# EAGLE schematic 40m_FT8_BD6CR (EAGLE 9.2.2)
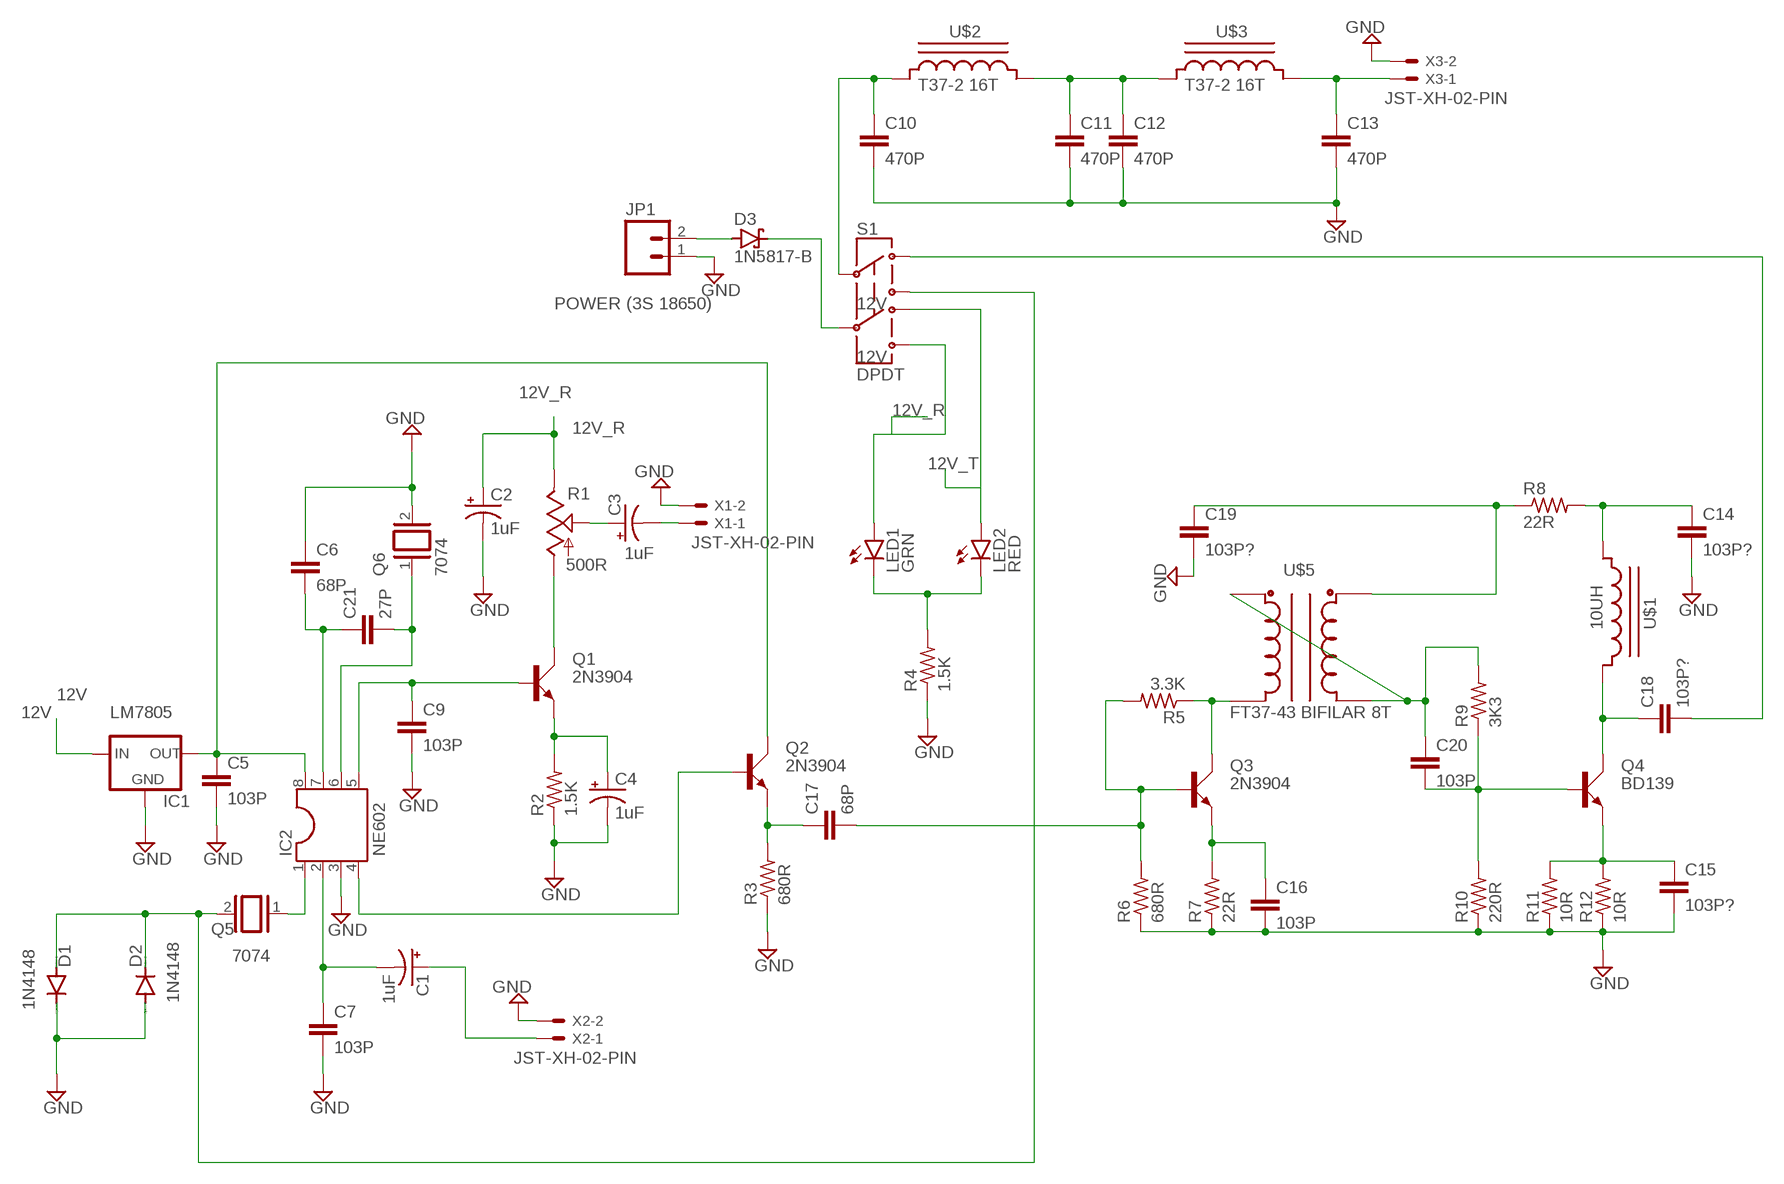
[diagram p0: schematic, sheet 1]

## Parts
C1  1uF  CPOL-USE2-4  [E2-4]
C2  1uF  CPOL-USE2-4  [E2-4]
C3  1uF  CPOL-USE2-4  [E2-4]
C4  1uF  CPOL-USE2-4  [E2-4]
C5  103P  C-EU050-025X075  [C050-025X075]
C6  68P  C-EU050-025X075  [C050-025X075]
C7  103P  C-EU050-025X075  [C050-025X075]
C9  103P  C-EU050-025X075  [C050-025X075]
C10  470P  C-EU050-025X075  [C050-025X075]
C11  470P  C-EU050-025X075  [C050-025X075]
C12  470P  C-EU050-025X075  [C050-025X075]
C13  470P  C-EU050-025X075  [C050-025X075]
C14  103P?  C-EU050-025X075  [C050-025X075]
C15  103P?  C-EU050-025X075  [C050-025X075]
C16  103P  C-EU050-025X075  [C050-025X075]
C17  68P  C-EU050-025X075  [C050-025X075]
C18  103P?  C-EU050-025X075  [C050-025X075]
C19  103P?  C-EU050-025X075  [C050-025X075]
C20  103P  C-EU050-025X075  [C050-025X075]
C21  27P  C-EU050-025X075  [C050-025X075]
D1  1N4148  1N4148DO35-10  [DO35-10]
D2  1N4148  1N4148DO35-10  [DO35-10]
D3  1N5817-B  [DO41-7.6]
IC1  LM7805  V_REG_78XXSIDE  [78XXL]
IC2  NE602  DIL8  [DIL08]
JP1  POWER (3S 18650)  M02-JST-2-PTH-NO_SILK  [JST-2-PTH-NS]
LED1  GRN  LED5MM  [LED_5MM]
LED2  RED  LED5MM  [LED_5MM]
Q1  2N3904  [TO92D]
Q2  2N3904  [TO92D]
Q3  2N3904  [TO92D]
Q4  BD139  2N3904  [TO92D]
Q5  7074  XTAL/S  [QS]
Q6  7074  XTAL/S  [QS]
R1  500R  TRIM_US-CT6  [CT6]
R2  1.5K  R-US_0207/10  [0207/10]
R3  680R  R-US_0207/10  [0207/10]
R4  1.5K  R-US_0207/10  [0207/10]
R5  3.3K  R-US_0207/10  [0207/10]
R6  680R  R-US_0207/10  [0207/10]
R7  22R  R-US_0207/10  [0207/10]
R8  22R  R-US_0207/10  [0207/10]
R9  3K3  R-US_0207/10  [0207/10]
R10  220R  R-US_0207/10  [0207/10]
R11  10R  R-US_0207/10  [0207/10]
R12  10R  R-US_0207/10  [0207/10]
S1  DPDT  SWITCH-DPDTAYZ0202  [AYZ0202]
U$1  10uH  T37_INDUCTOR_FLAT  [T37_INDUCTOR]
U$2  T37-2 16T  T37_INDUCTOR_FLAT  [T37_INDUCTOR]
U$3  T37_INDUCTOR_FLAT  [T37_INDUCTOR]
U$5  FT37-43 BIFILAR 8T  T37_TRANSFORMER  [T37_TRANSFORMER]
X1  JST-XH-02-PIN  JST-XH-02-PIN-LONG-PAD  [JST-XH-02-PACKAGE-LONG-PAD]
X2  JST-XH-02-PIN  JST-XH-02-PIN-LONG-PAD  [JST-XH-02-PACKAGE-LONG-PAD]
X3  JST-XH-02-PIN  JST-XH-02-PIN-LONG-PAD  [JST-XH-02-PACKAGE-LONG-PAD]

## Nets
12V: D3.C IC1.IN S1.5
12V_R: C2.+ LED1.A R1.E S1.6
12V_T: LED2.A S1.4
GND: C2.- C4.- C5.2 C6.1 C7.2 C9.2 C10.2 C11.2 C12.2 C13.2 C14.2 C15.2 C16.2 C19.2 D1.C D2.A IC1.GND IC2.3 JP1.1 Q6.2 R2.1 R3.1 R4.1 R6.1 R7.1 R10.1 R11.1 R12.1 X1.2 X2.2 X3.2
N$1: C3.+ R1.S
N$2: C5.1 IC1.OUT IC2.8 Q2.C
N$3: C13.1 U$3.CA X3.1
N$4: C11.1 C12.1 U$2.CA U$3.CB
N$5: C10.1 S1.2 U$2.CB
N$6: D3.A JP1.2
N$7: C3.- X1.1
N$9: C18.1 Q4.C U$1.CA
N$10: C14.1 R8.2 U$1.CB
N$11: C19.1 R8.1 U$5.C2B
N$13: C20.1 R9.2 U$5.C1B U$5.C2A
N$14: C20.2 Q4.B R9.1 R10.2
N$15: LED1.K(C) LED2.K(C) R4.2
N$16: Q3.C R5.1 U$5.C1A
N$17: C17.2 Q3.B R5.2 R6.2
N$18: C16.1 Q3.E R7.2
N$19: C17.1 Q2.E R3.2
N$21: C9.1 IC2.5 Q1.B
N$22: Q1.C R1.A
N$23: IC2.1 Q5.1
N$24: C6.2 C21.1 IC2.7
N$25: C21.2 IC2.6 Q6.1
N$26: D1.A D2.C Q5.2 S1.3
N$27: C1.+ X2.1
N$28: C1.- C7.1 IC2.2
N$29: C4.+ Q1.E R2.2
N$30: IC2.4 Q2.B
N$31: C18.2 S1.1
N$33: C15.1 Q4.E R11.2 R12.2

## Library data of the parts
C1-C4 = rcl:CPOL-US: POLARIZED CAPACITOR, American symbol; SPICEPREFIX: C
C5-C7 C9-C21 = rcl:C-EU: CAPACITOR, European symbol; SPICEPREFIX: C
D1 D2 = diode:1N4148: DIODE high speed (Philips)
D3 = diode:1N581*: 1.0A SCHOTTKY BARRIER RECTIFIER Source: http://www.diodes.com/datasheets/ds23001.pdf
IC1 = SparkFun-PowerIC:V_REG_78XX: Voltage Regulator Standard 7805 5V regulator. IGO (Input Ground Output). Spark Fun Electronics SKU : COM-00107
IC2 = ic-package:DIL8: Dual In Line / Socket
JP1 = SparkFun-Connectors:M02: Standard 2-pin 0.1" header. Use with - straight break away headers ( PRT-00116) - right angle break away headers (PRT-00553) - swiss pins (PRT-00743) - machine pins (PRT-00117) - female headers (PRT-00115) Molex polarized connector foot print use with: PRT-08233 with associated crimp pins and housings. 2.54_SCREWTERM for use with PRT-10571. 3.5mm Screw Terminal footprints for PRT-08084 5mm Screw Terminal footprints for use with PRT-08432
LED1 LED2 = SparkFun-LED:LED: LED (Generic) Standard schematic elements and footprints for 5mm, 3mm, 1206, and 0603 sized LEDs. Generic LEDs with no color specified.
Q1-Q4 = transistor-small-signal:2N3904: NPN TRANSISTOR
Q5 Q6 = special:XTAL/S: CRYSTAL
R1 = pot:TRIM_US-: POTENTIOMETER
R2-R12 = rcl:R-US_: RESISTOR, American symbol; SPICEPREFIX: R
S1 = SparkFun-Electromechanical:SWITCH-DPDT: DPDT Version of the COM-00597; PROD_ID: SWCH-08179
U$1 = toroid:T37_INDUCTOR_FLAT: Inductor wound on a T37 Toroid; 10UH: 10UH
U$2 U$3 = toroid:T37_INDUCTOR_FLAT: Inductor wound on a T37 Toroid; T37-2_16T: T37-2 16T
U$5 = toroid:T37_TRANSFORMER: Transformer wound on a T37 Toroid
X1-X3 = Rembrandt Electronics - JST XH Connectors v1-0:JST-XH-02-PIN: JST XH Connector 2 Pin Wire to board connector. Pitch: 2,54 mm, (0.100") Number of pins: 2 Created by Rembrandt Electronics www.rembrandtelectronics.com

## Net classes
0 default: width 0.762 mm, clearance 0.762 mm
1 Jim: width 0.914 mm, clearance 0.914 mm